# EAGLE design HyperLight_S_rev1.0 (EAGLE 9.3.2)
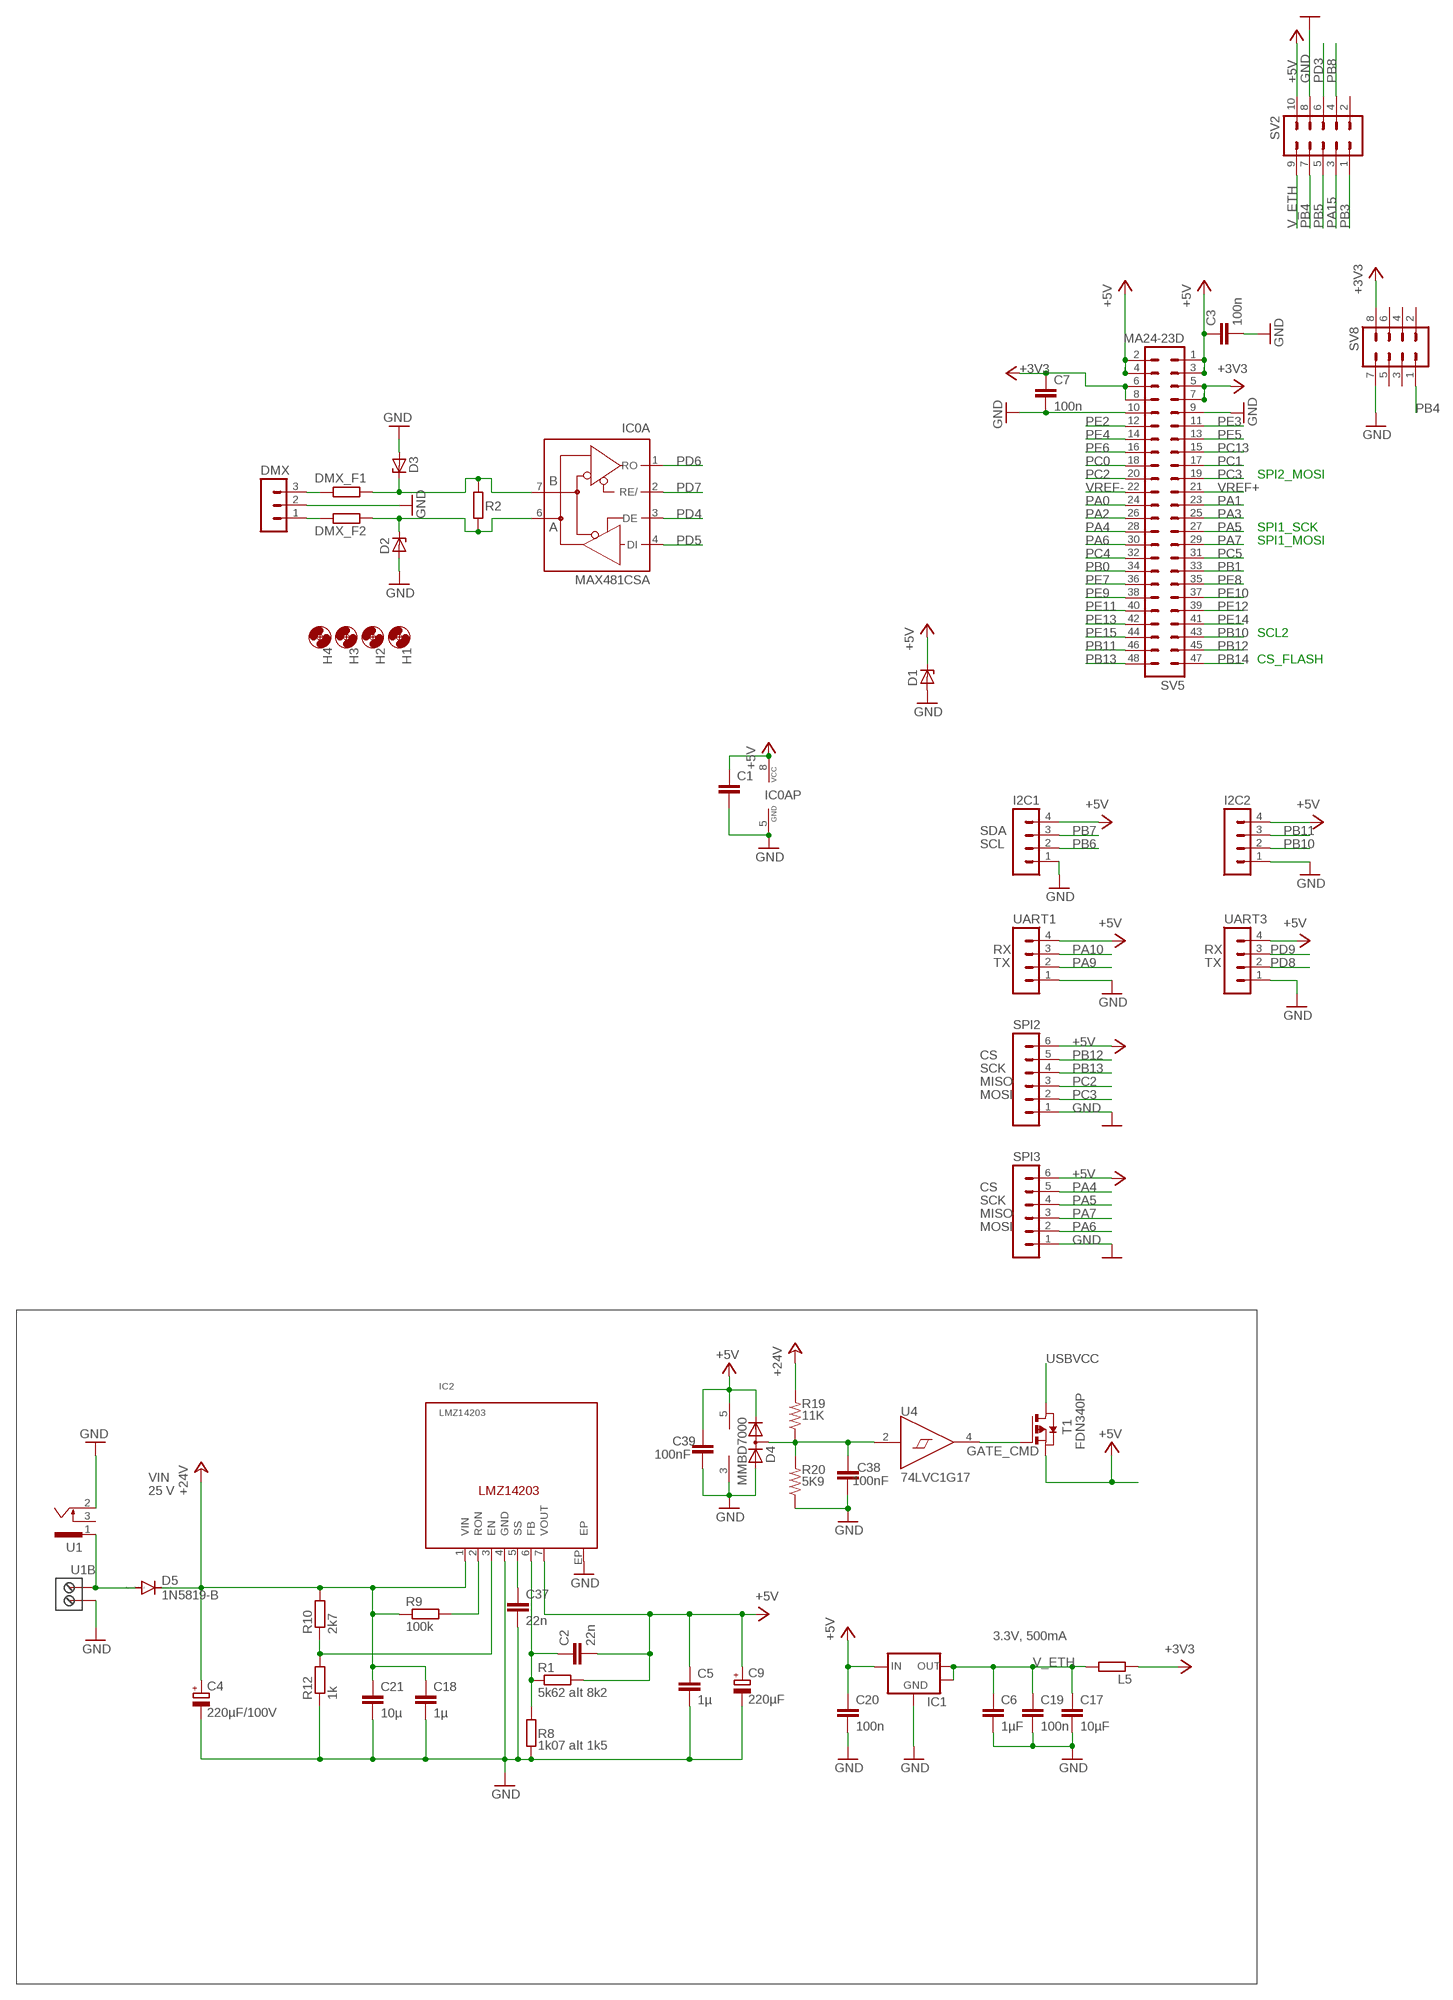
[diagram p0: schematic, sheet 1, part 1 of 2]
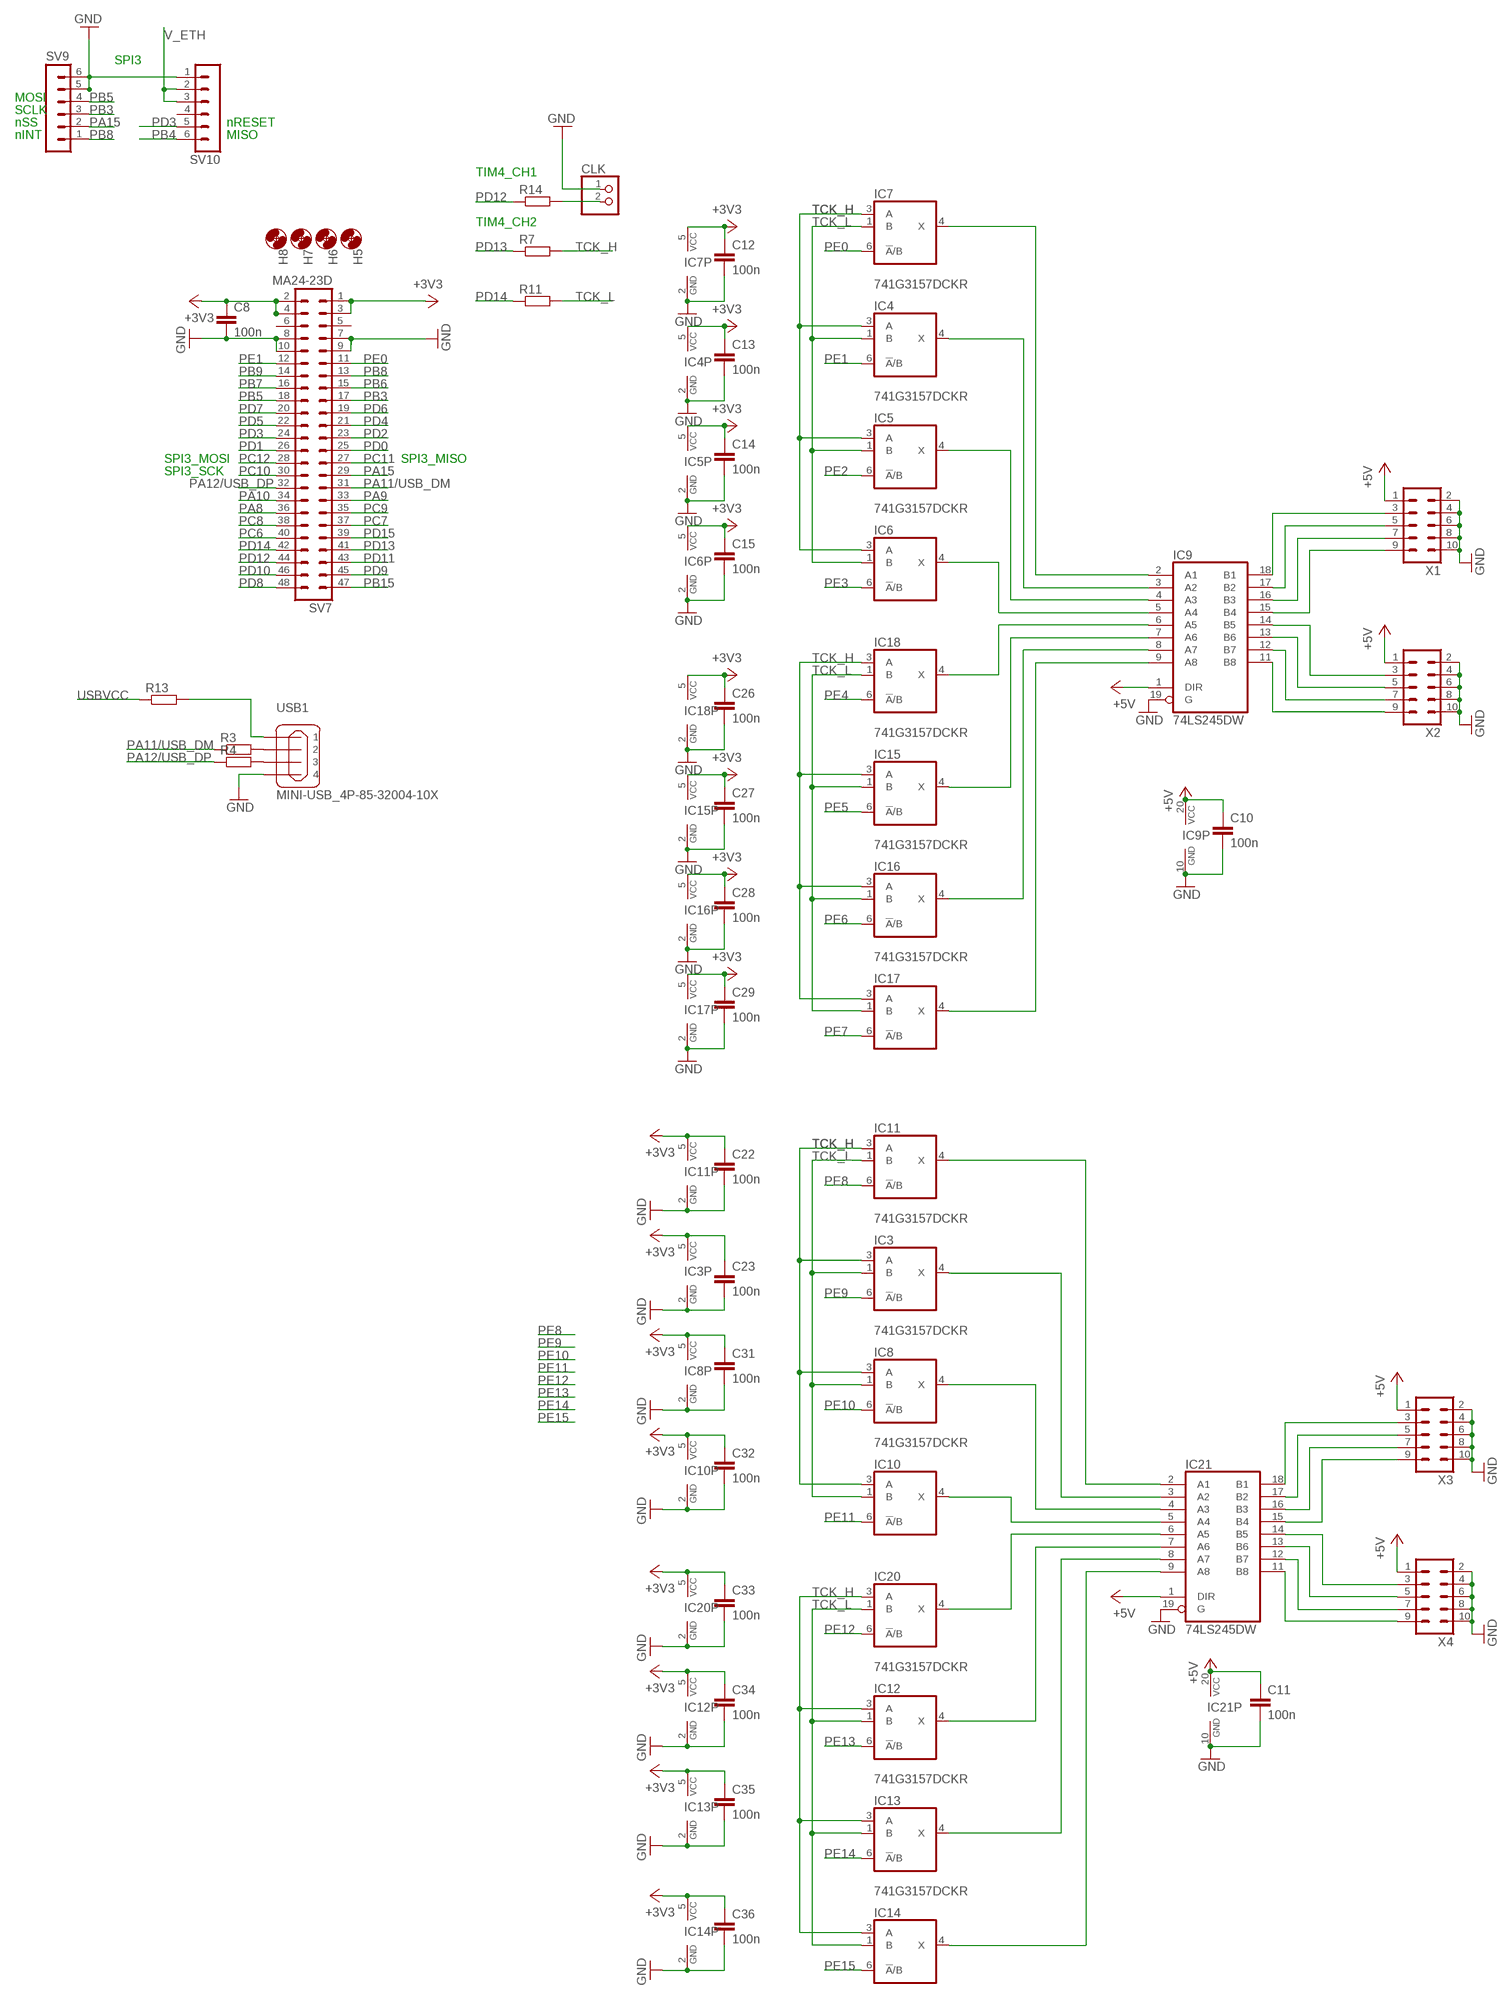
[diagram p1: schematic, sheet 1, part 2 of 2]

## Parts
C1  C-EUC0805  [C0805]
C2  22n  C-EUC0805  [C0805]
C3  100n  C-EUC0805  [C0805]
C4  220µF/100V  CPOL-EU153CLV-0810  [153CLV-0810]
C5  1µ  C-EUC0805  [C0805]
C6  1µF  C-EUC0805  [C0805]
C7  100n  C-EUC0805  [C0805]
C8  100n  C-EUC0805  [C0805]
C9  220µF  CPOL-EU153CLV-0810  [153CLV-0810]
C10  100n  C-EUC0603  [C0603]
C11  100n  C-EUC0603  [C0603]
C12  100n  C-EUC0603  [C0603]
C13  100n  C-EUC0603  [C0603]
C14  100n  C-EUC0603  [C0603]
C15  100n  C-EUC0603  [C0603]
C17  10µF  C-EUC0805  [C0805]
C18  1µ  C-EUC0805  [C0805]
C19  100n  C-EUC0805  [C0805]
C20  100n  C-EUC0805  [C0805]
C21  10µ  C-EUC0805  [C0805]
C22  100n  C-EUC0603  [C0603]
C23  100n  C-EUC0603  [C0603]
C26  100n  C-EUC0603  [C0603]
C27  100n  C-EUC0603  [C0603]
C28  100n  C-EUC0603  [C0603]
C29  100n  C-EUC0603  [C0603]
C31  100n  C-EUC0603  [C0603]
C32  100n  C-EUC0603  [C0603]
C33  100n  C-EUC0603  [C0603]
C34  100n  C-EUC0603  [C0603]
C35  100n  C-EUC0603  [C0603]
C36  100n  C-EUC0603  [C0603]
C37  22n  C-EUC0805  [C0805]
C38  100nF  C-EUC0402  [C0402]
C39  100nF  C-EUC0402  [C0402]
CLK  PINHD-1X2  [1X02]
D1  ZENER-DIODESMB  [SMB]
D2  ZENER-DIODESMB  [SMB]
D3  ZENER-DIODESMB  [SMB]
D4  MMBD7000  BAV199W  [SC70-3-R]
D5  1N5819-B  ES2D  [SMB]
DMX  MA03-1  [MA03-1]
DMX_F1  R-EU_R0805  [R0805@1]
DMX_F2  R-EU_R0805  [R0805@1]
H1  MOUNT-HOLE3.2  [3,2]
H2  MOUNT-HOLE3.2  [3,2]
H3  MOUNT-HOLE3.2  [3,2]
H4  MOUNT-HOLE3.2  [3,2]
H5  MOUNT-HOLE3.2  [3,2]
H6  MOUNT-HOLE3.2  [3,2]
H7  MOUNT-HOLE3.2  [3,2]
H8  MOUNT-HOLE3.2  [3,2]
I2C1  MA04-1  [MA04-1]
I2C2  MA04-1  [MA04-1]
IC0A  MAX481CSA  [SO08]
IC1  LM1117  [SOT223]
IC2  LMZ14203  [TO-PMOD]
IC3  741G3157DCKR  [DCK_R-PDSO-G6]
IC4  741G3157DCKR  [DCK_R-PDSO-G6]
IC5  741G3157DCKR  [DCK_R-PDSO-G6]
IC6  741G3157DCKR  [DCK_R-PDSO-G6]
IC7  741G3157DCKR  [DCK_R-PDSO-G6]
IC8  741G3157DCKR  [DCK_R-PDSO-G6]
IC9  74LS245DW  [SO20W]
IC10  741G3157DCKR  [DCK_R-PDSO-G6]
IC11  741G3157DCKR  [DCK_R-PDSO-G6]
IC12  741G3157DCKR  [DCK_R-PDSO-G6]
IC13  741G3157DCKR  [DCK_R-PDSO-G6]
IC14  741G3157DCKR  [DCK_R-PDSO-G6]
IC15  741G3157DCKR  [DCK_R-PDSO-G6]
IC16  741G3157DCKR  [DCK_R-PDSO-G6]
IC17  741G3157DCKR  [DCK_R-PDSO-G6]
IC18  741G3157DCKR  [DCK_R-PDSO-G6]
IC20  741G3157DCKR  [DCK_R-PDSO-G6]
IC21  74LS245DW  [SO20W]
L5  R-EU_R0603  [R0603]
R1  5k62 alt 8k2  R-EU_R0805  [R0805@1]
R2  R-EU_R0805  [R0805@1]
R3  R-EU_R0805  [R0805@1]
R4  R-EU_R0805  [R0805@1]
R7  R-EU_R0805  [R0805@1]
R8  1k07 alt 1k5  R-EU_R0805  [R0805@1]
R9  100k  R-EU_R0805  [R0805@1]
R10  2k7  R-EU_R0805  [R0805@1]
R11  R-EU_R0805  [R0805@1]
R12  1k  R-EU_R0805  [R0805@1]
R13  R-EU_R1206  [R1206@1]
R14  R-EU_R0805  [R0805@1]
R19  11K  R-US_R0402  [R0402]
R20  5K9  R-US_R0402  [R0402]
SPI2  MA06-1  [MA06-1]
SPI3  MA06-1  [MA06-1]
SV2  MA05-2  [MA05-2]
SV5  MA24-23D  [HDRVR48W64P254_2X24_6096X508X762B]
SV7  MA24-23D  [HDRVR48W64P254_2X24_6096X508X762B]
SV8  MA04-2MALE_3D  [HDRV8W64P254_2X4_1016X508X838B]
SV9  MA06-1FEMALE_3D  [HDRVR6W64P254_1X6_1524X254X762B]
SV10  MA06-1FEMALE_3D  [HDRVR6W64P254_1X6_1524X254X762B]
T1  FDN340P  PMOSSOT23  [SOT-23]
U1  733980-62  [733980-62]
U1B  RIACON101-02  [RIACON101-02]
U4  74LVC1G17  [SOT-553]
UART1  MA04-1  [MA04-1]
UART3  MA04-1  [MA04-1]
USB1  MINI-USB_4P-85-32004-10X  [85-32004-10X]
X1  MA05-2MA05-2S  [MA05-2S]
X2  MA05-2MA05-2S  [MA05-2S]
X3  MA05-2MA05-2S  [MA05-2S]
X4  MA05-2MA05-2S  [MA05-2S]

## Nets
+3V3: C7.1 C8.1 C12.1 C13.1 C14.1 C15.1 C22.1 C23.1 C26.1 C27.1 C28.1 C29.1 C31.1 C32.1 C33.1 C34.1 C35.1 C36.1 IC3.5(VCC) IC4.5(VCC) IC5.5(VCC) IC6.5(VCC) IC7.5(VCC) IC8.5(VCC) IC10.5(VCC) IC11.5(VCC) IC12.5(VCC) IC13.5(VCC) IC14.5(VCC) IC15.5(VCC) IC16.5(VCC) IC17.5(VCC) IC18.5(VCC) IC20.5(VCC) L5.1 SV5.5 SV5.6 SV5.7 SV5.8 SV7.1 SV7.2 SV7.3 SV7.4 SV8.8
+5V: C1.1 C2.2 C3.1 C5.1 C9.+ C10.1 C11.1 C20.1 C39.2 D1.C D4.2(C) I2C1.4 I2C2.4 IC0A.8(VCC) IC1.3(IN) IC2.7(VOUT) IC9.1(DIR) IC9.20(VCC) IC21.1(DIR) IC21.20(VCC) R1.2 SPI2.6 SPI3.6 SV2.10 SV5.1 SV5.2 SV5.3 SV5.4 T1.2(S) U4.5(VCC) UART1.4 UART3.4 X1.1 X2.1 X3.1 X4.1
+24V: C4.+ C18.1 C21.1 D5.C IC2.1(VIN) R9.1 R10.2 R19.2
CMP: C38.2 D4.3(AC) R19.1 R20.2 U4.2(A)
GATE_CMD: T1.3(G) U4.4(Y)
GND: C1.2 C3.2 C4.- C5.2 C6.2 C7.2 C8.2 C9.- C10.2 C11.2 C12.2 C13.2 C14.2 C15.2 C17.2 C18.2 C19.2 C20.2 C21.2 C22.2 C23.2 C26.2 C27.2 C28.2 C29.2 C31.2 C32.2 C33.2 C34.2 C35.2 C36.2 C37.2 C38.1 C39.1 CLK.1 D1.A D2.A D3.A D4.1(A) DMX.2 I2C1.1 I2C2.1 IC0A.5(GND) IC1.1(GND) IC2.4(GND) IC2.EP IC3.2(GND) IC4.2(GND) IC5.2(GND) IC6.2(GND) IC7.2(GND) IC8.2(GND) IC9.10(GND) IC9.19(G) IC10.2(GND) IC11.2(GND) IC12.2(GND) IC13.2(GND) IC14.2(GND) IC15.2(GND) IC16.2(GND) IC17.2(GND) IC18.2(GND) IC20.2(GND) IC21.10(GND) IC21.19(G) R8.1 R12.1 R20.1 SPI2.1 SPI3.1 SV2.8 SV5.9 SV5.10 SV7.7 SV7.8 SV7.9 SV7.10 SV8.7 SV9.5 SV9.6 SV10.1 U1.2 U1B.P$2 U4.3(GND) UART1.1 UART3.1 USB1.4 X1.2 X1.4 X1.6 X1.8 X1.10 X2.2 X2.4 X2.6 X2.8 X2.10 X3.2 X3.4 X3.6 X3.8 X3.10 X4.2 X4.4 X4.6 X4.8 X4.10
N$1: IC7.4(X) IC9.2(A1)
N$2: IC5.4(X) IC9.4(A3)
N$3: R3.2 USB1.2
N$4: IC6.4(X) IC9.5(A4)
N$9: IC4.4(X) IC9.3(A2)
N$10: IC9.18(B1) X1.3
N$11: D3.C DMX_F1.1 IC0A.7(B) R2.2
N$12: D2.C DMX_F2.1 IC0A.6(A) R2.1
N$13: R4.2 USB1.3
N$16: C2.1 IC2.6(FB) R1.1 R8.2
N$19: IC9.6(A5) IC18.4(X)
N$20: IC2.2(RON) R9.2
N$21: IC11.4(X) IC21.2(A1)
N$22: C37.1 IC2.5(SS)
N$23: IC9.9(A8) IC17.4(X)
N$24: IC2.3(EN) R10.1 R12.2
N$25: D5.A U1.1 U1B.P$1
N$26: IC9.8(A7) IC16.4(X)
N$27: IC9.7(A6) IC15.4(X)
N$28: IC9.17(B2) X1.5
N$29: IC9.16(B3) X1.7
N$30: IC9.15(B4) X1.9
N$31: DMX.3 DMX_F1.2
N$32: DMX.1 DMX_F2.2
N$33: IC8.4(X) IC21.4(A3)
N$34: IC10.4(X) IC21.5(A4)
N$35: IC20.4(X) IC21.6(A5)
N$36: IC14.4(X) IC21.9(A8)
N$37: IC13.4(X) IC21.8(A7)
N$38: IC12.4(X) IC21.7(A6)
N$39: IC3.4(X) IC21.3(A2)
N$40: R13.2 USB1.1
N$41: CLK.2 R14.2
N$42: IC21.18(B1) X3.3
N$43: IC21.17(B2) X3.5
N$44: IC21.16(B3) X3.7
N$45: IC21.15(B4) X3.9
N$46: IC21.14(B5) X4.3
N$47: IC21.13(B6) X4.5
N$48: IC21.12(B7) X4.7
N$49: IC21.11(B8) X4.9
N$50: IC9.14(B5) X2.3
N$51: IC9.13(B6) X2.5
N$52: IC9.12(B7) X2.7
N$53: IC9.11(B8) X2.9
PA0: SV5.24
PA1: SV5.23
PA2: SV5.26
PA3: SV5.25
PA4: SPI3.5 SV5.28
PA5: SPI3.4 SV5.27
PA6: SPI3.2 SV5.30
PA7: SPI3.3 SV5.29
PA8: SV7.36
PA9: SV7.33 UART1.2
PA10: SV7.34 UART1.3
PA11/USB_DM: R3.1 SV7.31
PA12/USB_DP: R4.1 SV7.32
PA15: SV2.3 SV7.29 SV9.2
PB0: SV5.34
PB1: SV5.33
PB3: SV2.1 SV7.17 SV9.3
PB4: SV2.7 SV8.1 SV10.6
PB5: SV2.5 SV7.18 SV9.4
PB6: I2C1.2 SV7.15
PB7: I2C1.3 SV7.16
PB8: SV2.4 SV7.13 SV9.1
PB9: SV7.14
PB10: I2C2.2 SV5.43
PB11: I2C2.3 SV5.46
PB12: SPI2.5 SV5.45
PB13: SPI2.4 SV5.48
PB14: SV5.47
PB15: SV7.47
PC0: SV5.18
PC1: SV5.17
PC2: SPI2.3 SV5.20
PC3: SPI2.2 SV5.19
PC4: SV5.32
PC5: SV5.31
PC6: SV7.40
PC7: SV7.37
PC8: SV7.38
PC9: SV7.35
PC10: SV7.30
PC11: SV7.27
PC12: SV7.28
PC13: SV5.15
PD0: SV7.25
PD1: SV7.26
PD2: SV7.23
PD3: SV2.6 SV7.24 SV10.5
PD4: IC0A.3(DE) SV7.21
PD5: IC0A.4(DI) SV7.22
PD6: IC0A.1(RO) SV7.19
PD7: IC0A.2(RE/) SV7.20
PD8: SV7.48 UART3.2
PD9: SV7.45 UART3.3
PD10: SV7.46
PD11: SV7.43
PD12: R14.1 SV7.44
PD13: R7.1 SV7.41
PD14: R11.1 SV7.42
PD15: SV7.39
PE0: IC7.6(!A!/B) SV7.11
PE1: IC4.6(!A!/B) SV7.12
PE2: IC5.6(!A!/B) SV5.12
PE3: IC6.6(!A!/B) SV5.11
PE4: IC18.6(!A!/B) SV5.14
PE5: IC15.6(!A!/B) SV5.13
PE6: IC16.6(!A!/B) SV5.16
PE7: IC17.6(!A!/B) SV5.36
PE8: IC11.6(!A!/B) SV5.35
PE9: IC3.6(!A!/B) SV5.38
PE10: IC8.6(!A!/B) SV5.37
PE11: IC10.6(!A!/B) SV5.40
PE12: IC20.6(!A!/B) SV5.39
PE13: IC12.6(!A!/B) SV5.42
PE14: IC13.6(!A!/B) SV5.41
PE15: IC14.6(!A!/B) SV5.44
TCK_H: IC3.3(A) IC4.3(A) IC5.3(A) IC6.3(A) IC7.3(A) IC8.3(A) IC10.3(A) IC11.3(A) IC12.3(A) IC13.3(A) IC14.3(A) IC15.3(A) IC16.3(A) IC17.3(A) IC18.3(A) IC20.3(A) R7.2
TCK_L: IC3.1(B) IC4.1(B) IC5.1(B) IC6.1(B) IC7.1(B) IC8.1(B) IC10.1(B) IC11.1(B) IC12.1(B) IC13.1(B) IC14.1(B) IC15.1(B) IC16.1(B) IC17.1(B) IC18.1(B) IC20.1(B) R11.2
USBVCC [usbvcc]: R13.1 T1.1(D)
V_ETH: C6.1 C17.1 C19.1 IC1.2(OUT) IC1.4(PAD) L5.2 SV2.9 SV10.2 SV10.3
VREF+: SV5.21
VREF-: SV5.22
Unconnected: SV2.2 SV7.5 SV7.6 SV8.2 SV8.3 SV8.4 SV8.5 SV8.6 SV10.4 U1.3

## Notes on the sheet
- SPI3
- MOSI
- SCLK
- nSS | nRESET
- nINT | MISO
- TIM4_CH1
- TIM4_CH2
- SPI2_MOSI
- SPI3_MOSI | SPI3_MISO
- SPI1_SCK | SPI3_SCK
- SPI1_MOSI
- SCL2
- CS_FLASH
- SDA
- SCL
- RX | RX
- TX | TX
- CS
- SCK
- MISO
- MOSI
- CS
- SCK
- MISO
- MOSI
- VIN
- 25 V
- 3.3V, 500mA

## Library data of the parts
C1 C10-C15 C22 C23 C26-C29 C31-C36 C39 = rcl:C-EU: CAPACITOR, European symbol
C2 C3 C5-C8 C17-C21 C37 = rcl:C-EU: CAPACITOR, European symbol; SPICEPREFIX: C
C4 C9 = rcl:CPOL-EU: POLARIZED CAPACITOR, European symbol; SPICEPREFIX: C
C38 = SmartPrj:C-EU: CAPACITOR, European symbol
CLK = pinhead:PINHD-1X2: PIN HEADER
D1-D3 = diode:ZENER-DIODE: Z-Diode
D4 = diode:BAV199: DIODE low-leakage double diode
D5 = diode:ES2D: DIODE super fast rectifier, 2 A
DMX = con-pin-header:MA03-1: PIN HEADER
DMX_F1 DMX_F2 R1-R4 R7-R14 = rcl:R-EU_: RESISTOR, European symbol
H1-H8 = holes_new:MOUNT-HOLE: MOUNTING HOLE with drill center marker
I2C1 I2C2 UART1 UART3 = con-pin-header:MA04-1: PIN HEADER
IC0A = maxim:MAX481CSA: RS485 TRANSEIVER; MF: MAXIM; MPN: MAX481CSA; OC_FARNELL: unknown; OC_NEWARK: 90C3817
IC1 = v-reg-3:LM1117
IC2 = ti_import:LMZ14203
IC3-IC8 IC10-IC18 IC20 = 74xx-little-de:74*1G3157: Single-Pole, Double-Throw Analog Switch Source: http://focus.ti.com/lit/ds/symlink/sn74lvc1g3157.pdf
IC9 IC21 = 74xx-eu:74*245: Octal BUS TRANSCEIVER, 3-state
L5 = rcl:R-EU_: RESISTOR, European symbol; SPICEPREFIX: R
R19 R20 = rcl:R-US_: RESISTOR, American symbol
SPI2 SPI3 SV9 SV10 = con-pin-header:MA06-1: PIN HEADER
SV2 X1-X4 = con-pin-header:MA05-2: PIN HEADER
SV5 SV7 = con-pin-header:MA24-2
SV8 = con-pin-header:MA04-2: PIN HEADER
T1 = zetex:PMOSSOT23: MOS FET
U1 = con-conrad:73398?: FEMALE PRINT CONNECTOR Niedervolt-Steckverbinder Distributor Conrad
U1B = con-riacon:RIACON101-02
U4 = bibaja:74LVC1G17: Single Schmitt-Trigger Buffer, 1.65-5.5V (Alternate part NL17SZ17)
USB1 = con-cypressindustries:MINI-USB_4P-: MINI USB 4 Pol. Source: www.cypressindustries.com; OC_FARNELL: unknown; OC_NEWARK: unknown

## Net classes
1 power: width 0.61 mm, drill 0.508 mm, clearance 0.152 mm
2 gnd: width 0.305 mm, drill 0.508 mm, clearance 0.152 mm
3 usbvcc: width 0.508 mm, drill 0.508 mm, clearance 0.152 mm

## Board
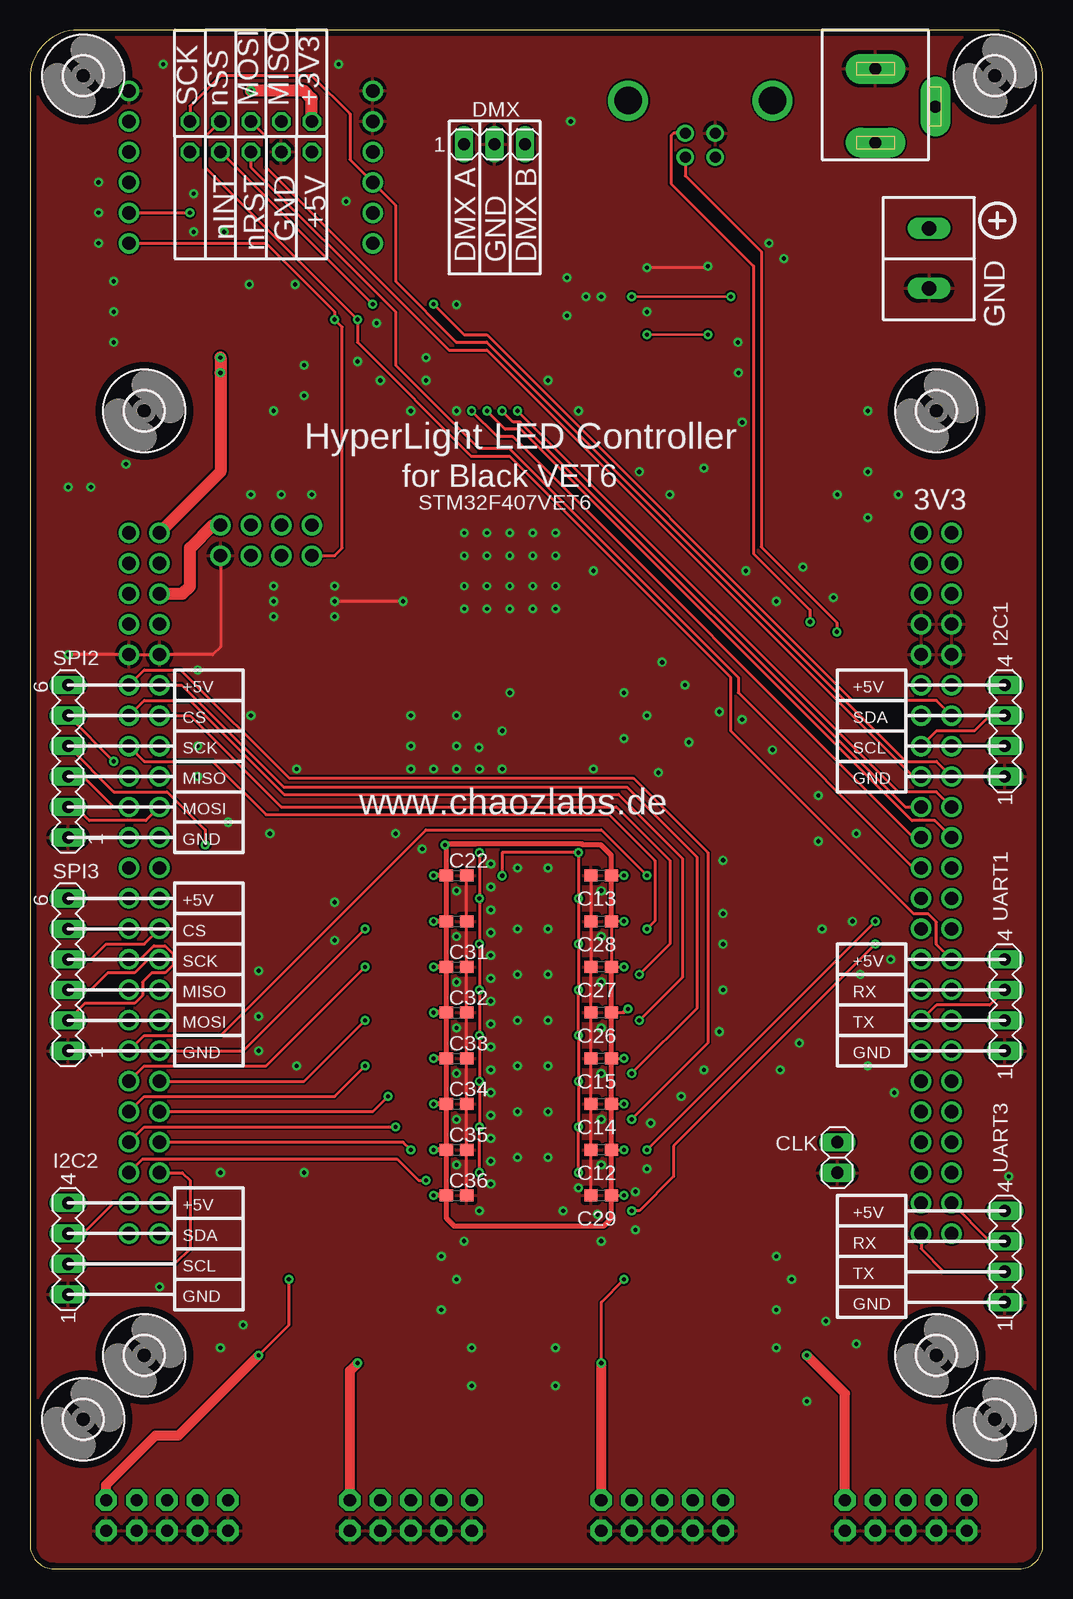
[diagram p2: board, top side]
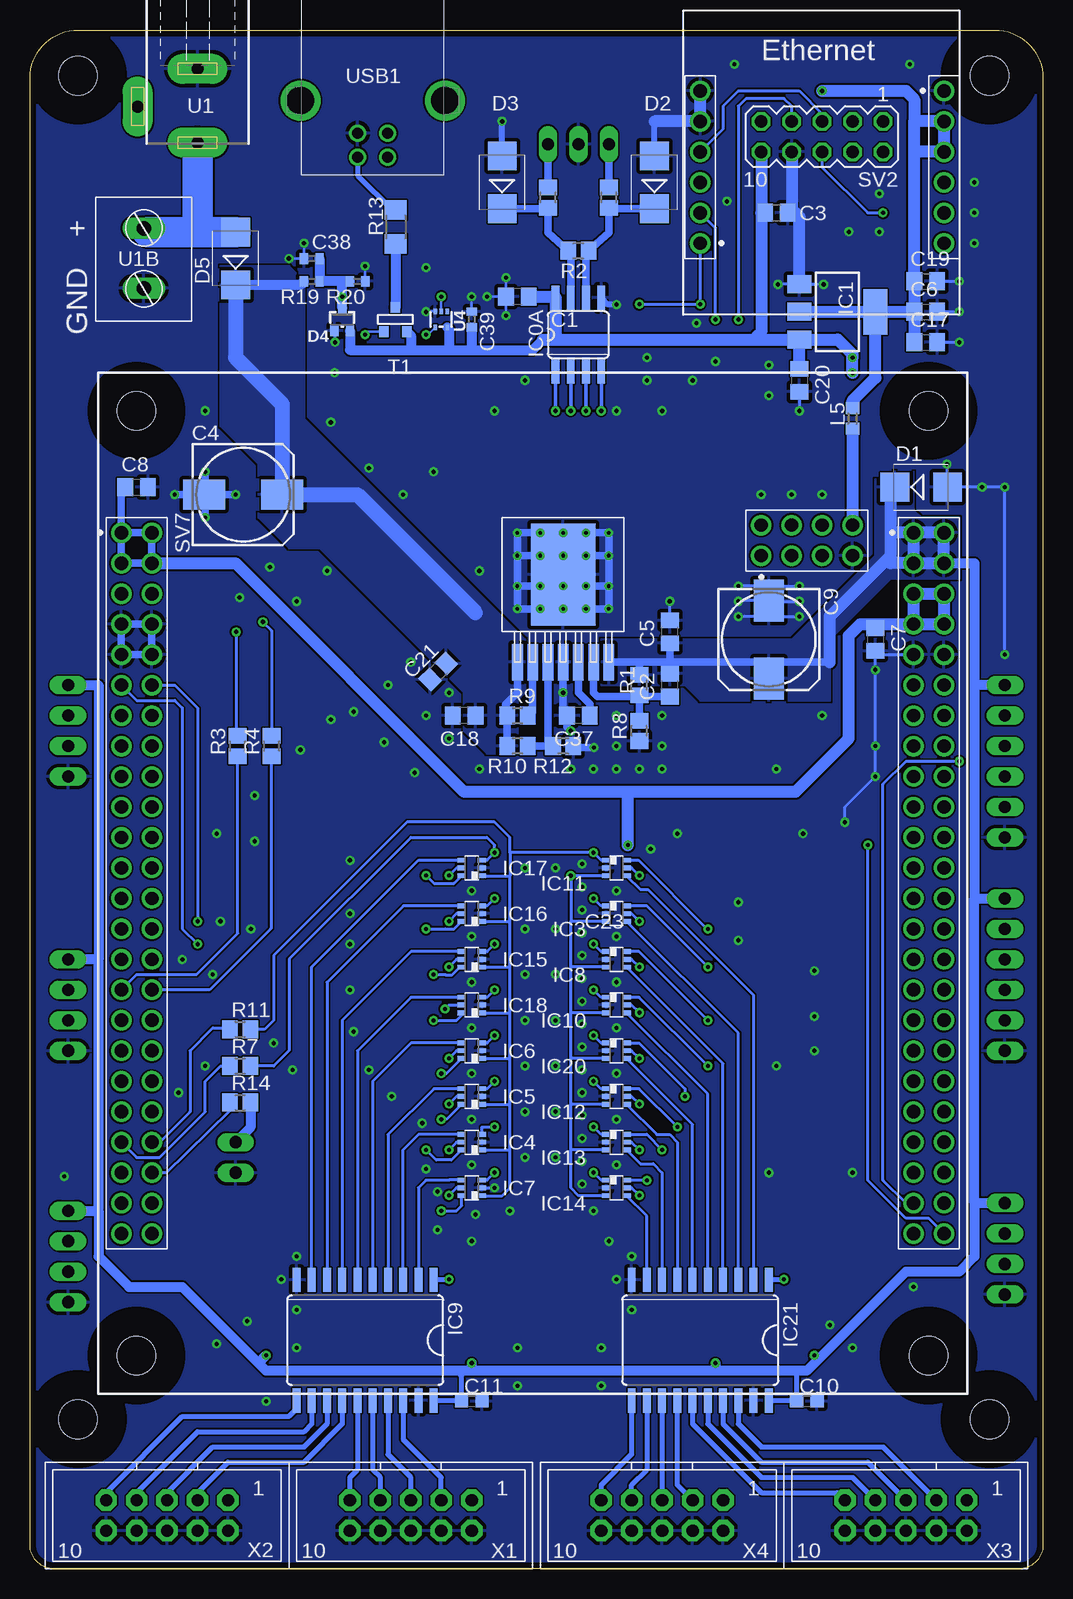
[diagram p3: board, bottom side, seen from below]

Size 84.46 x 128.27 mm. Coordinates in mm from the lower left corner, seen from the top.
Outline: 0,124.27 0,2 arc90 2,0 82.46,0 arc90 84.46,2 84.46,124.27 arc90 80.46,128.27 4,128.27 arc90 0,124.27
Copper layers (1*16): Top 0.035mm / dielectric 1.5mm / Bottom 0.035mm
Design rules "default_2": minimum track width 6mil, minimum drill 0.35mm, track to track 6mil, track to pad 6mil, pad to pad 6mil, via to via 6mil, smd to smd 6mil, copper to edge 20mil, drill to drill 6mil, minimum pad ring 10mil, minimum via ring 8mil, stop-mask expansion 4mil, vias tented up to drill 14mil, thermal gap 12mil

### Footprints (pad centres in the part's own frame; a part is rotated, then mirrored left to right if it is on the bottom)
C0805 = smd 1.3 x 1.5: 1 -0.95,0; 2 0.95,0
153CLV-0810 = smd 3.5 x 2.5: + 3.25,0; - -3.25,0
C0603 = smd 1.1 x 1: 1 -0.85,0; 2 0.85,0
C0402 = smd 0.7 x 0.9: 1 -0.65,0; 2 0.65,0
1X02 = drill 1.016 long: 1 -1.27,0; 2 1.27,0
SMB = smd 2.4 x 2.4: A 2.2,0; C -2.2,0
SC70-3-R = smd 0.7 x 0.9: 1 -0.65,-0.95; 2 0.65,-0.95; 3 0,0.95
MA03-1 = drill 1.016 long: 1 -2.54,0; 2 0,0; 3 2.54,0
R0805@1 = smd 1.3 x 1.5: 1 -0.85,0; 2 0.85,0
3,2 = hole 3.2: 0,0
MA04-1 = drill 1.016 long: 1 -3.81,0; 2 -1.27,0; 3 1.27,0; 4 3.81,0
SO08 = smd 0.66 x 2.032: 1 -1.905,-3.073; 2 -0.635,-3.073; 3 0.635,-3.073; 4 1.905,-3.073; 5 1.905,3.073; 6 0.635,3.073; 7 -0.635,3.073; 8 -1.905,3.073
SOT223 = smd 1.5 x 2: 1 -2.3,-3.15; 2 0,-3.15; 3 2.3,-3.15 | smd 3.8 x 2: 4 0,3.15
TO-PMOD = smd 0.89 x 3.06: 1 -3.81,0; 2 -2.54,0; 3 -1.27,0; 4 0,0; 5 1.27,0; 6 2.54,0; 7 3.81,0 | smd 5.35 x 8.51: EP 0,7.305
DCK_R-PDSO-G6 = smd 0.4 x 0.7: 1 -0.65,-0.85; 2 0,-0.85; 3 0.65,-0.85; 4 0.65,0.85; 5 0,0.85; 6 -0.65,0.85
SO20W = smd 0.66 x 2.032: 1 -5.715,-5.029; 2 -4.445,-5.029; 3 -3.175,-5.029; 4 -1.905,-5.029; 5 -0.635,-5.029; 6 0.635,-5.029; 7 1.905,-5.029; 8 3.175,-5.029; 9 4.445,-5.029; 10 5.715,-5.029; 11 5.715,5.029; 12 4.445,5.029; 13 3.175,5.029; 14 1.905,5.029; 15 0.635,5.029; 16 -0.635,5.029; 17 -1.905,5.029; 18 -3.175,5.029; 19 -4.445,5.029; 20 -5.715,5.029
R0603 = smd 1 x 1.1: 1 -0.85,0; 2 0.85,0
R1206@1 = smd 1.6 x 1.803: 1 -1.422,0; 2 1.422,0
R0402 = smd 0.7 x 0.9: 1 -0.65,0; 2 0.65,0
MA06-1 = drill 1.016 long: 1 -6.35,0; 2 -3.81,0; 3 -1.27,0; 4 1.27,0; 5 3.81,0; 6 6.35,0
MA05-2 = drill 1.016 octagon: 1 -5.08,-1.27; 2 -5.08,1.27; 3 -2.54,-1.27; 4 -2.54,1.27; 5 0,-1.27; 6 0,1.27; 7 2.54,-1.27; 8 2.54,1.27; 9 5.08,-1.27; 10 5.08,1.27
HDRVR48W64P254_2X24_6096X508X762B = drill 1.105 pad 1.705: 1 0,0; 2 0,2.54; 3 2.54,0; 4 2.54,2.54; 5 5.08,0; 6 5.08,2.54; 7 7.62,0; 8 7.62,2.54; 9 10.16,0; 10 10.16,2.54; 11 12.7,0; 12 12.7,2.54; 13 15.24,0; 14 15.24,2.54; 15 17.78,0; 16 17.78,2.54; 17 20.32,0; 18 20.32,2.54; 19 22.86,0; 20 22.86,2.54; 21 25.4,0; 22 25.4,2.54; 23 27.94,0; 24 27.94,2.54; 25 30.48,0; 26 30.48,2.54; 27 33.02,0; 28 33.02,2.54; 29 35.56,0; 30 35.56,2.54; 31 38.1,0; 32 38.1,2.54; 33 40.64,0; 34 40.64,2.54; 35 43.18,0; 36 43.18,2.54; 37 45.72,0; 38 45.72,2.54; 39 48.26,0; 40 48.26,2.54; 41 50.8,0; 42 50.8,2.54; 43 53.34,0; 44 53.34,2.54; 45 55.88,0; 46 55.88,2.54; 47 58.42,0; 48 58.42,2.54
HDRV8W64P254_2X4_1016X508X838B = drill 1.105 pad 1.705: 1 0,0; 2 0,2.54; 3 2.54,0; 4 2.54,2.54; 5 5.08,0; 6 5.08,2.54; 7 7.62,0; 8 7.62,2.54
HDRVR6W64P254_1X6_1524X254X762B = drill 1.105 pad 1.705: 1 0,0; 2 2.54,0; 3 5.08,0; 4 7.62,0; 5 10.16,0; 6 12.7,0
SOT-23 = smd 0.787 x 0.889: 1 0.025,-1.016; 2 -0.94,1.016; 3 0.991,1.016
733980-62 = drill 1 pad 2.5 long: 1 0,8.57; 2 0,2.42; 3 5,5.57
RIACON101-02 = drill 1.2 long: P$1 -0.03,2.52; P$2 -0.03,-2.485
SOT-553 = smd 0.3 x 0.45: 1 -0.5,-0.675; 2 0,-0.675; 3 0.5,-0.675; 4 0.5,0.675; 5 -0.5,0.675
85-32004-10X = drill 0.92 pad 1.27: 1 4.71,-1.25; 2 4.71,1.25; 3 2.71,1.25; 4 2.71,-1.25 | drill 2.3 pad 3: M1 0,6.02; M2 0,-6.02
MA05-2S = drill 1.016 pad 1.778 octagon: 1 -5.08,-1.27; 2 -5.08,1.27; 3 -2.54,-1.27; 4 -2.54,1.27; 5 0,-1.27; 6 0,1.27; 7 2.54,-1.27; 8 2.54,1.27; 9 5.08,-1.27; 10 5.08,1.27

### Placement (x,y rotation side)
C1  43.81,106.04 180 bottom
C2  31.12,73.66 90 bottom
C3  22.23,113.03 0 bottom
C4  66.67,89.53 0 bottom
C5  31.12,78.1 90 bottom
C6  9.78,104.77 0 bottom
C7  13.97,77.47 270 bottom
C8  75.56,90.17 0 bottom
C9  22.86,77.47 270 bottom
C10  19.69,13.97 0 bottom
C11  47.62,13.97 0 bottom
C12  47.62,34.93 180 top
C13  47.62,57.79 180 top
C14  47.62,38.73 180 top
C15  47.62,42.55 180 top
C17  9.78,102.23 0 bottom
C18  48.26,71.12 180 bottom
C19  9.78,107.31 0 bottom
C20  20.32,99.06 270 bottom
C21  50.42,74.8 225 bottom
C22  35.56,57.79 0 top
C23  35.56,53.98 0 top
C26  47.62,46.36 180 top
C27  47.62,50.16 180 top
C28  47.62,53.98 180 top
C29  47.62,31.12 180 top
C31  35.56,50.16 0 top
C32  35.56,46.36 0 top
C33  35.56,42.55 0 top
C34  35.56,38.73 0 top
C35  35.56,34.93 0 top
C36  35.56,31.12 0 top
C37  38.73,71.12 180 bottom
C38  60.96,109.22 0 bottom
C39  47.62,104.14 270 bottom
CLK  67.31,34.29 90 top
D1  10.16,90.17 0 bottom
D2  32.39,115.57 90 bottom
D3  45.09,115.57 90 bottom
D4  58.42,104.14 0 bottom
D5  67.31,109.22 90 bottom
DMX  38.73,118.74 0 top
DMX_F1  41.27,114.3 90 bottom
DMX_F2  36.2,114.3 90 bottom
H1  4.45,12.46 0 top
H2  80.44,12.46 0 top
H3  4.45,124.46 0 top
H4  80.44,124.46 0 top
H5  9.53,17.78 0 top
H6  75.56,17.78 0 top
H7  9.53,96.52 0 top
H8  75.56,96.52 0 top
I2C1  81.28,69.85 90 top
I2C2  3.18,26.67 90 top
IC0A  38.73,102.87 0 bottom
IC1  17.14,104.77 270 bottom
IC2  40.01,75.56 0 bottom
IC3  35.56,54.61 270 bottom
IC4  47.62,35.56 90 bottom
IC5  47.62,39.37 90 bottom
IC6  47.62,43.18 90 bottom
IC7  47.62,31.75 90 bottom
IC8  35.56,50.8 270 bottom
IC9  56.52,19.05 180 bottom
IC10  35.56,46.99 270 bottom
IC11  35.56,58.42 270 bottom
IC12  35.56,39.37 270 bottom
IC13  35.56,35.56 270 bottom
IC14  35.56,31.75 270 bottom
IC15  47.62,50.8 90 bottom
IC16  47.62,54.61 90 bottom
IC17  47.62,58.42 90 bottom
IC18  47.62,46.99 90 bottom
IC20  35.56,43.18 270 bottom
IC21  28.57,19.05 180 bottom
L5  15.88,95.88 90 bottom
R1  33.66,73.66 90 bottom
R2  38.73,109.85 180 bottom
R3  67.13,68.58 90 bottom
R4  64.31,68.58 90 bottom
R7  66.93,41.91 0 bottom
R8  33.66,69.85 90 bottom
R9  43.81,71.12 0 bottom
R10  43.81,68.58 180 bottom
R11  66.93,44.96 0 bottom
R12  40.01,68.58 180 bottom
R13  53.98,111.85 90 bottom
R14  66.93,38.86 0 bottom
R19  60.96,107.31 180 bottom
R20  57.15,107.31 180 bottom
SPI2  3.18,67.31 90 top
SPI3  3.18,49.53 90 top
SV2  18.41,119.38 180 bottom
SV5  10.79,86.36 270 bottom
SV7  76.84,86.36 270 bottom
SV8  23.5,84.45 0 bottom
SV9  28.57,110.49 90 bottom
SV10  8.26,123.19 270 bottom
T1  53.98,104.14 180 bottom
U1  70.49,127.46 180 bottom
U1B  74.93,109.22 0 bottom
U4  50.16,104.14 180 bottom
UART1  81.28,46.99 90 top
UART3  81.28,26.04 90 top
USB1  55.88,122.38 270 bottom
X1  52.7,4.45 180 bottom
X2  73.03,4.45 180 bottom
X3  11.43,4.45 180 bottom
X4  31.75,4.45 180 bottom

### Tracks (layer width: path | path; a pad name or v marks a point on that pad's centre or on a via)
+3V3  (via drill 0.35)
  Top 0.152: v49.85,46.66 49.95,46.46 49.45,46.46 49.45,46.36
  Top 0.254: 34.71,34.29 C35.1 C34.1 | v49.53,53.98 C28.1 C27.1 v49.53,50.16 | C15.1 v49.53,42.55 | C14.1 v49.53,38.73 | C12.1 v49.53,34.93 | C29.1 v49.53,31.12 | C13.1 48.9,57.79 v49.53,57.79 | 34.92,60.33 37.17,60.33 37.19,60.35 47.6,60.35 | 34.92,60.33 34.71,60.11 C22.1 | v34.61,60.33 34.92,60.33 | C26.1 49.45,46.36 49.53,46.36 49.85,46.67
  Top 0.406: C22.1 34.71,60.22 v34.61,60.33 34.71,60.42 46.02,60.42 46.1,60.35 47.6,60.35 48.48,59.48 C13.1 C28.1 48.48,57.37 48.9,57.79 | C27.1 C26.1 C15.1 C14.1 C12.1 C29.1 48.48,29.21 47.84,28.57 35.34,28.57 34.71,29.21 C36.1 | C23.1 C22.1 | C22.1 v33.66,57.79 | C23.1 v33.66,53.98 | C31.1 v33.66,50.16 | C31.1 C23.1 | C32.1 C31.1 | C32.1 v33.66,46.36 | C33.1 C32.1 | C33.1 v33.66,42.55 | C33.1 C34.1 34.29,38.73 | 34.29,38.73 v33.66,38.73 | 34.29,38.73 34.71,38.31 C35.1 v33.66,34.93 | C36.1 34.71,34.29 | C36.1 v33.66,31.12
  Top 1.016: SV5.5 12.7,81.28 13.34,81.91 13.34,85.09 15.24,86.99 SV8.8
  Bottom 0.254: 76.84,89.85 C8.1 | C7.1 13.97,78.74 | IC17.5 48.9,58.41 v49.53,57.79 | IC16.5 48.9,54.61 v49.53,53.98 | v49.85,46.66 49.52,46.99 IC18.5 | IC15.5 48.9,50.8 v49.53,50.16 | IC6.5 48.9,43.18 v49.53,42.55 | IC5.5 48.9,39.37 v49.53,38.73 | IC4.5 48.9,35.56 v49.53,34.93 | IC7.5 48.9,31.75 v49.53,31.12 | IC14.5 34.29,31.75 v33.66,31.12 | IC13.5 34.29,35.56 v33.66,34.93 | IC12.5 34.29,39.37 v33.66,38.73 | IC20.5 34.29,43.18 v33.66,42.55 | IC10.5 34.29,46.99 v33.66,46.36 | IC8.5 34.29,50.8 v33.66,50.16 | IC3.5 34.29,54.61 v33.66,53.98 | IC11.5 34.29,58.42 v33.66,57.79
  Bottom 0.61: SV7.1 SV7.2 SV7.4 SV7.3 SV7.1 | SV7.1 76.84,89.85
  Bottom 1.016: SV5.7 13.97,78.74 15.24,78.74 16.19,77.79 16.19,69.21 20.64,64.77 34.61,64.77 | L5.1 SV8.8 | SV5.7 SV5.8 SV5.6 SV5.5 SV5.7 | SV7.4 67.31,83.82 48.26,64.77 34.61,64.77 | v34.61,60.33 34.61,64.77
+5V  (via drill 0.35)
  Top 0.254: v47.62,17.14 47.62,22.23 v49.53,24.13 | v19.05,17.78 21.59,20.32 v21.59,24.13
  Top 0.813: v19.05,17.78 12.38,11.11 10.48,11.11 6.35,6.99 X3.1 | v64.77,17.78 67.94,14.61 X2.1 | X1.1 v47.62,17.14 | X4.1 26.67,16.51 v27.3,17.14
  Top 1.016: SV5.1 15.88,91.44 v15.88,99.69 v15.88,100.96
  Bottom 0.254: v49.53,24.13 49.58,24.08 | v21.59,24.13 21.64,24.08 | 40.64,102.87 40.64,102.45
  Bottom 0.406: 20.32,16.51 20.54,16.3 C10.1 20.59,14.02 IC21.20 | 48.9,16.51 48.48,16.09 C11.1 48.53,14.02 IC9.20 | 49.58,24.08 IC9.1 | 21.64,24.08 IC21.1
  Bottom 0.61: 40.64,106.58 IC0A.8 | IC2.7 33.66,75.56 | 33.66,75.56 31.12,75.56 | R1.2 33.66,75.56 | C2.2 31.12,75.56 | C5.1 31.12,75.56 | 31.12,75.56 22.86,75.56 | 22.86,75.56 17.78,75.56 | C9.+ 22.86,75.56
  Bottom 0.813: UART3.4 78.74,29.84 | 78.74,29.84 78.74,50.8 | 78.74,50.8 UART1.4 | I2C1.4 78.74,73.66 78.74,50.8 | 78.74,29.84 78.74,26.04 76.2,23.5 71.75,23.5 65.41,17.14 | 5.71,30.48 5.71,26.04 6.99,24.77 11.43,24.77 18.73,17.46 | 5.71,30.48 I2C2.4 | 5.71,30.48 5.71,55.88 | 5.71,55.88 SPI3.6 | SPI2.6 5.71,73.66 | 5.71,73.66 5.71,55.88 | D4.2 57.79,103.17 57.79,101.6 52.7,101.6 | 52.7,101.6 49.53,101.6 | 49.53,101.6 47.62,101.6 | 47.62,101.6 42.55,101.6 41.7,102.45 | C39.2 47.62,101.6 | U4.5 49.53,103.33 49.53,101.6 | T1.2 52.7,102.79 52.7,101.6 | 18.73,17.46 19.69,16.51 20.32,16.51 27.3,16.51 | v19.05,17.78 18.73,17.46 | 65.41,17.14 64.77,16.51 48.9,16.51 47.62,16.51 | 27.3,16.51 47.62,16.51 | v47.62,17.14 47.62,16.51 | v27.3,17.14 27.3,16.51 | v64.77,17.78 65.41,17.14 | SV5.4 5.71,83.82 5.71,73.66 | 23.92,102.66 24.13,102.45
  Bottom 1.016: SV5.3 12.7,83.82 12.7,84.45 | 12.7,84.45 17.78,79.38 17.78,75.56 | 12.7,84.45 12.7,86.36 | 12.7,86.36 12.7,89.53 | SV5.1 12.7,86.36 | 40.64,102.87 IC0A.8 40.74,106.04 C1.1 | v15.88,99.69 v15.88,100.96 15.88,101.23 17.12,102.47 IC1.3 20.32,102.45 | C20.1 20.32,102.45 | 41.7,102.45 40.64,102.45 24.13,102.45 20.32,102.45 | SV5.3 SV5.4 SV5.2 SV5.1 | SV5.1 SV5.3 | SV2.10 23.5,113.03 | 23.5,113.03 23.5,103.08 23.92,102.66 | C3.1 23.5,113.03
  pour Bottom: 36.83,77.47 36.83,73.66 29.84,73.66 28.57,72.39 17.78,72.39 17.78,77.47 12.7,82.55 6.99,82.55 6.99,87.63 10.16,87.63 10.79,88.27 10.79,91.44 13.34,91.44 13.97,90.8 13.97,84.45 20.96,77.47
+24V
  Bottom 0.61: R10.2 R9.1 44.81,72.02 43.81,73.02 IC2.1
  Bottom 0.813: R19.2 61.91,107.02 D5.C
  Bottom 1.27: D5.C 67.31,100.96 63.42,97.08 C4.+ 57.15,89.53 47.31,79.69
  pour Bottom: 48.26,73.02 48.26,69.85 46.35,67.94 43.81,67.94 43.81,72.39 43.18,73.02 43.18,77.47 61.59,95.88 61.59,107.31 62.87,108.58 68.58,108.58 68.58,95.25 65.41,92.07 65.41,87.63 62.87,85.09 60.33,85.09
CMP  (via drill 0.35)
  Top 0.203: v50.16,106.04 v58.42,106.04
  Bottom 0.203: U4.2 v50.16,106.04
  Bottom 0.813: R20.2 58.42,107.31 | 58.42,107.31 R19.1 C38.2 | D4.3 v58.42,106.04 58.42,107.31
GATE_CMD  (via drill 0.35)
  Top 0.203: v56.52,102.87 v51.44,102.87
  Bottom 0.203: U4.4 51.26,102.87 v51.44,102.87 | v56.52,102.87 56.26,103.12 T1.3
GND  (via drill 0.3, 0.35)
  Top 0.254: SV8.7 15.88,76.83 15.24,76.2 SV5.9 SV5.10 v3.18,76.2 | v31.12,80.64 v25.4,80.64 | v56.52,108.58 56.39,108.46 v51.45,108.46 | v45.72,31.76 v45.72,31.75 | C29.2 C12.2 C14.2 C15.2 C26.2 C27.2 C28.2 C13.2 | C36.2 C22.2
  Bottom 0.203: C39.1 v47.62,106.04 | C1.2 v46.35,106.04 | C1.2 v44.77,107.63 | v44.77,104.45 C1.2 | v61.62,110.49 v61.61,110.48 C38.1 v62.87,109.22 | R20.1 56.5,108.57 v56.52,108.58 | D4.1 59.01,103.13 v59.01,102.23 | U4.3 51.4,104.81 v51.44,104.77
  Bottom 0.254: 13.97,76.2 SV5.9 | v16.51,62.23 16.51,63.5 v13.97,66.04 v13.97,68.58 v13.97,74.93 C7.2 | C9.- 25.32,80.72 v25.4,80.64 | C9.- 22.79,80.64 v20.32,80.64 | v8,92.07 7.87,91.95 7.96,91.86 D1.A v5.08,90.17 v3.18,90.17 v3.18,76.2 | C20.2 v20.32,96.52 | v22.1,107.06 22.08,107.07 IC1.1 18.3,107.07 v18.29,107.06 | C19.2 v6.99,107.31 | C6.2 v6.99,104.77 | C17.2 v6.99,102.23 | 22.86,79.45 22.93,79.38 v25.4,79.38 | C9.- 22.86,79.45 | C9.- 22.86,81.91 v25.4,81.91 | 22.86,79.45 22.79,79.38 v20.32,79.38 | C9.- 21.66,81.91 v20.32,81.91 | C5.2 v31.12,80.64 | IC7.2 v45.72,31.76
  Bottom 0.508: IC0A.5 36.3,105.41 35.56,105.41 v35.56,105.39 | D2.A 32.39,120.65 | D3.A v45.09,120.65
  Bottom 0.61: IC2.EP v40.01,81.91 | v40.01,81.91 v40.01,80.01 | v40.01,80.01 40.01,79.38 40.64,80.01 | 40.64,80.01 v41.91,80.01 v43.81,80.01 v43.81,81.91 | v43.81,81.91 v43.81,84.45 | v43.81,84.45 v43.81,86.36 v41.91,86.36 v40.01,86.36 v38.1,86.36 v36.2,86.36 v36.2,84.45 | v36.2,84.45 v36.2,81.91 | v36.2,81.91 v36.2,80.01 v38.1,80.01 v40.01,80.01 | v40.01,80.01 40.64,80.01 | v43.81,81.91 v41.91,81.91 v40.01,81.91 | v40.01,81.91 v38.1,81.91 v36.2,81.91 | v36.2,84.45 v38.1,84.45 v40.01,84.45 v41.91,84.45 v43.81,84.45 | C4.- 69.85,89.61 | 69.85,89.61 v69.85,91.44 | 69.85,89.61 v69.85,87.63 | C4.- v72.39,89.53 | C4.- v67.31,89.53 | IC2.4 v40.01,73.02 40.01,71.44 C37.2 39.69,70.16 v39.37,69.85 | R12.1 39.04,68.46 v37.45,68.46 | SV7.9 SV7.10 SV7.8 SV7.7 SV7.9
  Bottom 1.016: SV2.8 20.96,113.35 | 20.96,113.35 C3.2 | IC1.1 20.3,112.69 20.96,113.35 | SV9.6 SV9.5 32.39,120.65
  other vias: 35.56,56.52 46.99,83.18 53.34,89.53 23.5,89.53 20.96,89.53 18.41,89.53 22.86,97.79 22.86,100.33 38.42,56.83 38.42,53.02 38.42,49.21 38.42,45.4 38.42,37.78 38.42,41.59 38.42,33.97 40.64,34.29 43.18,34.29 43.18,38.1 40.64,38.1 40.64,41.91 43.18,41.91 40.64,45.72 43.18,45.72 40.64,49.53 43.18,49.53 40.64,53.34 43.18,53.34 40.64,58.42 43.18,58.42 63.5,24.13 62.23,26.04 62.23,21.59 35.56,24.13 34.29,26.04 34.29,21.59 52.7,75.56 49.53,73.02 54.61,73.66 51.44,71.12 49.53,69.21 59.69,83.18 46.99,66.67 31.75,66.67 62.23,80.64 39.37,66.67 35.56,66.67 37.47,66.67 33.66,66.67 35.56,68.58 31.75,68.58 35.56,71.12 31.75,71.12 18.41,71.12 22.23,66.67 50.8,91.44 45.72,96.52 43.18,99.06 33.02,99.06 29.21,99.06 31.75,96.52 35.56,96.52 59.05,99.69 69.85,96.52 38.42,32.07 38.42,35.88 38.42,39.69 38.42,43.5 38.42,47.31 38.42,51.12 38.42,54.93 38.42,58.74 47.62,33.66 47.62,37.47 47.62,41.27 47.62,45.09 47.62,48.9 47.62,52.7 47.62,56.52 57.79,48.26 57.47,44.77 57.79,52.07 57.79,54.61 56.2,41.59 54.29,39.37 51.75,37.15 51.44,33.34 50.48,31.43 47.31,29.53 50.48,28.26 35.56,33.66 35.56,37.47 35.56,41.27 35.56,45.09 35.56,48.9 35.56,52.7 30.48,61.28 66.04,53.34 69.22,49.53 68.58,53.98 71.75,50.8 64.13,43.81 69.85,41.91 62.55,41.59 72.07,39.69 81.6,32.7 22.86,33.02 15.88,33.02 22.23,41.91 19.05,43.18 47.62,27.3 36.2,27.3 37.47,29.84 44.45,29.84 57.79,59.05 65.72,64.45 65.72,60.64 68.9,61.28 61.91,68.26 59.37,70.8 57.47,71.44 52.39,66.36 54.93,68.9 66.99,80.96 64.45,83.5 59.37,95.57 56.2,91.76 28.89,103.82 33.02,100.96 27.3,100.65 20,61.28 17.78,20.32 15.88,18.41 10.79,23.5 43.81,18.41 43.81,15.24 36.83,15.24 36.83,18.41 62.23,18.41 64.77,13.97 68.9,18.73 66.36,20.64 32.7,60.01 19.05,46.04 25.4,52.39 19.05,49.85 25.4,55.56 26.35,113.98 13.65,111.44 13.65,114.62 11.11,125.41 25.72,125.41 16.19,111.44 5.71,110.49 5.71,113.03 5.71,115.57
  pour Bottom (rank 6): -6.35,131.54 -6.35,-8.25 97.16,-8.25 97.16,131.54
  pour Top (rank 6): -5.08,-7.62 95.88,-7.62 95.88,129.64 -5.08,129.64
N$1
  Bottom 0.254: IC7.4 49.52,32.4 49.53,32.38 51.44,32.38 52.07,31.75 IC9.2
N$2
  Bottom 0.254: IC5.4 50.79,40.02 54.61,36.2 IC9.4
N$3  (via drill 0.35)
  Top 0.254: v67.27,78.09 67.27,78.88 60.96,85.18 60.96,109.8 54.64,116.12 54.64,117.66 USB1.2
  Bottom 0.254: v67.27,78.09 67.27,69.56 R3.2
N$4
  Bottom 0.254: IC9.5 55.88,40.64 52.69,43.83 IC6.4
N$9
  Bottom 0.254: IC4.4 52.05,36.21 53.34,34.93 IC9.3
N$10
  Bottom 0.406: IC9.18 53.34,10.8 50.16,7.62 X1.3
N$11
  Bottom 0.254: 39.37,109.49 R2.2 | DMX_F1.1 41.27,113.03 41.62,113.37
  Bottom 0.61: IC0A.7 39.37,109.49 | R2.2 41.27,111.39 41.27,113.03 | D3.C 41.62,113.37
N$12
  Bottom 0.254: DMX_F2.1 36.2,113.03 35.86,113.37
  Bottom 0.61: IC0A.6 38.1,109.49 R2.1 36.2,111.39 36.2,113.03 | D2.C 35.86,113.37
N$13  (via drill 0.35)
  Top 0.254: USB1.3 53.66,119.67 53.45,119.46 53.45,115.46 60.32,108.58 60.33,108.58 60.33,84.64 65.04,79.93 v65.04,78.93
  Bottom 0.254: v65.04,78.93 64.31,78.2 R4.2
N$16
  Bottom 0.152: R1.1 33.95,72.96 33.95,72.71
  Bottom 0.61: IC2.6 37.47,73.02 37.15,72.71 33.95,72.71 33.66,72.71 | C2.1 33.66,72.71 | R8.2 R1.1 33.66,72.71
N$19
  Bottom 0.254: IC9.6 57.15,43.18 52.69,47.64 IC18.4
N$20
  Bottom 0.61: IC2.2 42.55,71.39 R9.2
N$21
  Bottom 0.254: IC21.2 24.13,47.83 32.92,56.62 33.55,56.62 IC11.4
N$22
  Bottom 0.61: IC2.5 38.73,73.02 37.79,72.07 C37.1
N$23
  Bottom 0.254: IC9.9 60.96,50.16 52.05,59.07 IC17.4
N$24
  Bottom 0.61: IC2.3 41.27,68.58 | R10.1 41.27,68.58 | 41.27,68.58 R12.2
N$25
  Bottom 1.27: 67.63,111.74 D5.A | 74.64,111.42 U1B.P$1
  Bottom 2.54: D5.A 70.49,111.42 | 70.49,111.42 74.64,111.42 | U1.1 70.49,111.42
N$26
  Bottom 0.254: IC9.8 59.69,48.9 53.33,55.26 IC16.4
N$27
  Bottom 0.254: IC15.4 52.69,51.45 58.42,45.72 IC9.7
N$28
  Bottom 0.406: IC9.17 54.61,9.52 52.7,7.62 X1.5
N$29
  Bottom 0.406: IC9.16 55.88,8.25 55.24,7.62 X1.7
N$30
  Bottom 0.406: IC9.15 57.15,8.25 57.79,7.62 X1.9
N$31
  Bottom 0.61: DMX_F1.2 DMX.3
N$32
  Bottom 0.61: DMX_F2.2 DMX.1
N$33
  Bottom 0.254: IC21.4 26.67,42.11 IC8.4
N$34
  Bottom 0.254: IC21.5 27.94,39.57 IC10.4
N$35
  Bottom 0.254: IC21.6 29.21,37.03 IC20.4
N$36
  Bottom 0.254: IC21.9 33.02,29.41 IC14.4
N$37
  Bottom 0.254: IC13.4 33.55,33.76 32.48,33.76 31.75,33.02 IC21.8
N$38
  Bottom 0.254: IC12.4 32.19,36.2 31.12,36.2 30.48,35.56 IC21.7
N$39
  Bottom 0.254: IC21.3 25.4,44.65 IC3.4
N$40
  Bottom 0.406: USB1.1 57.13,116.14 54.26,113.28 R13.2
N$41
  Bottom 0.813: R14.2 66.08,36.79 CLK.2
N$42
  Bottom 0.406: IC21.18 25.4,12.07 23.5,10.16 13.34,10.16 X3.3
N$43
  Bottom 0.406: IC21.17 26.67,12.07 23.5,8.89 14.61,8.89 X3.5
N$44
  Bottom 0.406: IC21.16 27.94,12.07 23.5,7.62 15.88,7.62 X3.7
N$45
  Bottom 0.406: IC21.15 29.21,12.07 23.5,6.35 17.14,6.35 X3.9
N$46
  Bottom 0.406: X4.3 30.48,6.99 IC21.14
N$47
  Bottom 0.406: IC21.13 X4.5
N$48
  Bottom 0.406: IC21.12 33.02,8.25 34.29,6.99 X4.7
N$49
  Bottom 0.406: IC21.11 34.29,9.52 36.83,6.99 X4.9
N$50
  Bottom 0.406: IC9.14 58.42,12.07 61.59,8.89 67.94,8.89 70.49,6.35 X2.3
N$51
  Bottom 0.406: IC9.13 59.69,12.07 61.59,10.16 69.22,10.16 73.03,6.35 X2.5
N$52
  Bottom 0.406: IC9.12 60.96,12.07 61.59,11.43 70.49,11.43 75.56,6.35 X2.7
N$53
  Bottom 0.254: IC9.11 62.23,13.34
  Bottom 0.406: 62.23,13.34 62.87,12.7 71.75,12.7 78.1,6.35 X2.9
PA4
  Top 0.254: SV5.28 SPI3.5
PA5
  Top 0.254: SPI3.4 5.08,50.8 6.35,52.07 9.53,52.07 SV5.27
PA6
  Top 0.254: SV5.30 9.19,50.8 10.33,51.93 11.26,51.93 11.93,51.27 11.93,50.33 11.26,49.67 10.15,49.67 9.39,48.91 9.39,47.79 8.72,47.13 4.58,47.13 SPI3.2
PA7
  Top 0.254: SV5.29 9.86,50.8 8.72,49.67 6.49,49.67 5.08,48.26 SPI3.3
PA9
  Top 0.254: SV7.33 UART1.2
PA10
  Top 0.254: SV7.34 75.56,46.99 80.01,46.99 UART1.3
PA11/USB_DM
  Bottom 0.254: SV7.31 75.56,49.53 70.58,49.53 67.13,52.98 R3.1
PA12/USB_DP
  Bottom 0.254: SV7.32 69.49,48.26 64.36,53.39 64.36,67.68 R4.1
PA15  (via drill 0.35)
  Top 0.254: SV7.29 75.58,52.06 75.58,53.91 74.89,54.6 73.67,54.6 58.42,69.85 58.42,74.29 40.01,92.71 36.83,92.71 27.3,102.23 v27.3,104.14 14.61,116.84 14.61,119.38 SV2.3
  Bottom 0.254: v27.3,104.14 27.3,111.76 SV9.2
PB3
  Top 0.254: SV7.17 75.56,67.31 73.03,67.31 38.08,102.26 35.53,102.26 30.48,107.31 30.48,113.66 SV9.3 26.67,117.47 26.67,121.28 23.5,124.46 15.88,124.46 13.34,121.92 SV2.1
PB4  (via drill 0.35)
  Top 0.254: SV8.1 25.4,84.45 26.04,85.09 26.04,103.5 v25.4,104.14 25.4,104.77 19.69,110.49 SV10.6
  Bottom 0.254: SV2.7 20.96,121.92 21.59,122.55 24.77,122.55 25.4,121.92 v25.4,104.14
PB5
  Top 0.254: SV7.18 73.66,66.04 38.1,101.6 34.92,101.6 19.69,116.84 19.69,119.38 SV2.5
  Bottom 0.254: SV2.5 18.41,121.28 20.32,123.19 25.4,123.19 26.67,121.92 26.67,120.02 SV9.4
PB6
  Top 0.254: SV7.15 I2C1.2
PB7
  Top 0.254: I2C1.3 80.01,71.12 78.74,69.85 75.56,69.85 SV7.16
PB8  (via drill 0.35)
  Top 0.254: SV7.13 75.56,72.39 68.58,72.39 38.1,102.87 36.2,102.87 v33.66,105.41 | v28.57,105.41 SV2.4
  Bottom 0.254: v33.66,105.41 v28.57,105.41 SV9.1
PB10
  Top 0.254: SV5.43 12.7,33.02 13.34,32.38 13.34,26.67 12.07,25.4 I2C2.2
PB11
  Top 0.254: I2C2.3 4.45,27.94 6.99,30.48 SV5.46
PB12  (via drill 0.35)
  Top 0.254: SPI2.5 v6.99,67.31
  Bottom 0.254: SV5.45 11.43,30.48 13.34,32.38 | 13.34,32.38 13.36,32.38 | v6.99,67.31 11.43,67.31 13.34,65.4 13.34,32.38
PB13  (via drill 0.35)
  Top 0.254: SPI2.4 6.99,64.77 11.43,64.77 14.61,61.6 v14.61,60.33
  Bottom 0.254: SV5.48 9.53,29.21 11.43,29.21 14.61,32.38 v14.61,60.33
PC2
  Top 0.254: SV5.20 6.99,63.5 4.45,66.04 SPI2.3
PC3
  Top 0.254: SPI2.2 3.81,63.5 4.94,62.37 9.66,62.37 SV5.19
PD3  (via drill 0.35)
  Top 0.254: SV7.24 73.66,58.42 59.05,73.02 59.05,74.29 39.94,93.41 37.4,93.41 30.48,100.33 30.48,104.77 18.41,116.84 SV2.6 | SV10.5 v13.34,113.03
  Bottom 0.254: v13.34,113.03 14.61,113.03 18.41,116.84 SV2.6
PD4  (via drill 0.35)
  Top 0.254: SV7.21 75.43,62.37 73.52,62.37 40.89,95 39.62,95 v38.1,96.52
  Bottom 0.305: IC0A.3 v38.1,96.52
PD5  (via drill 0.35)
  Top 0.254: SV7.22 73.66,60.96 40.26,94.36 38.99,94.36 v36.83,96.52
  Bottom 0.305: v36.83,96.52 IC0A.4
PD6  (via drill 0.35)
  Top 0.254: SV7.19 75.56,64.77 72.39,64.77 v40.64,96.52
  Bottom 0.305: v40.64,96.52 IC0A.1
PD7  (via drill 0.35)
  Top 0.254: SV7.20 72.97,63.5 40.86,95.6 40.29,95.6 v39.37,96.52
  Bottom 0.305: IC0A.2 v39.37,96.52
PD8
  Top 0.254: SV7.48 74.29,26.67 76.2,24.77 UART3.2
PD9
  Top 0.254: UART3.3 80.01,27.3 SV7.45
PD12
  Bottom 0.254: R14.1 67.78,38.23 73.12,33.02 SV7.44
PD13
  Bottom 0.254: 67.94,41.91 R7.1 68.58,41.91 69.85,40.64 69.85,38.1 73.66,34.29 75.56,34.29 SV7.41
PD14
  Bottom 0.254: R11.1 67.91,45.09 69.22,45.09 71.12,43.18 71.12,38.1 73.66,35.56 SV7.42
PE0  (via drill 0.35)
  Top 0.254: v50.16,29.84 50.8,29.84 53.66,32.7 53.66,35.24 v70.49,52.07
  Bottom 0.254: v50.16,29.84 48.9,29.84 48.48,30.27 IC7.6 | SV7.11 75.56,72.39 72.39,72.39 71.75,71.75 71.75,53.34 v70.49,52.07
PE1  (via drill 0.35)
  Top 0.254: v51.44,34.93 v70.49,53.98
  Bottom 0.254: SV7.12 72.39,73.66 70.49,71.75 v70.49,53.98 | IC4.6 49.31,34.07 50.58,34.07 v51.44,34.93
PE2  (via drill 0.35)
  Top 0.254: SV5.12 9.53,74.93 12.58,74.93 21.61,65.9 50.31,65.9 56.52,59.69 56.52,43.81 v50.16,37.47
  Bottom 0.254: IC5.6 49.73,37.47 v50.16,37.47
PE3  (via drill 0.35)
  Top 0.254: SV5.11 12.64,73.66 21.15,65.15 49.78,65.15 55.59,59.34 55.59,46.7 v50.16,41.27
  Bottom 0.254: IC6.6 49.73,41.27 v50.16,41.27
PE4  (via drill 0.35)
  Top 0.254: SV5.14 9.53,72.39 13.34,72.39 21.18,64.54 49.06,64.54 54.38,59.22 54.38,49.3 v50.8,45.72
  Bottom 0.254: v50.8,45.72 48.9,45.72 48.48,46.14 IC18.6
PE5  (via drill 0.35)
  Top 0.254: SV5.13 13.34,71.12 20.96,63.5 48.9,63.5 53.34,59.05 53.34,52.07 v50.8,49.53
  Bottom 0.254: v50.8,49.53 49.83,49.53 49.8,49.51 49.26,49.51 48.62,50.15 IC15.6
PE6  (via drill 0.35)
  Top 0.254: SV5.16 9.53,67.31 15.24,67.31 19.69,62.87 48.26,62.87 52.09,59.03 52.09,54 v51.44,53.34
  Bottom 0.254: v51.44,53.34 49.83,53.34 49.8,53.32 49.12,53.32 IC16.6
PE7  (via drill 0.35)
  Top 0.254: SV5.36 9.53,44.45 15.88,44.45 33.02,61.6 47.62,61.6 v51.44,57.79
  Bottom 0.254: v51.44,57.79 50.78,57.13 49.12,57.13 IC17.6
PE8  (via drill 0.35)
  Top 0.254: SV5.35 17.78,43.18 v27.94,53.34
  Bottom 0.254: IC11.6 33.73,59.07 28,53.34 v27.94,53.34
PE9  (via drill 0.35)
  Top 0.254: 8.89,41.27 SV5.38 9.53,41.91 19.69,41.91 v27.94,50.16
  Bottom 0.254: v27.94,50.16 33.03,55.26 IC3.6
PE10  (via drill 0.35)
  Top 0.254: SV5.37 22.86,40.64 v27.94,45.72
  Bottom 0.254: IC8.6 33.67,51.45 v27.94,45.72
PE11  (via drill 0.35)
  Top 0.254: SV5.40 9.53,39.37 25.4,39.37 v27.94,41.91
  Bottom 0.254: v27.94,41.91 33.67,47.64 IC10.6
PE12  (via drill 0.35)
  Top 0.254: v29.84,39.37 28.57,38.1 SV5.39
  Bottom 0.254: IC20.6 33.67,43.83 29.84,40.01 v29.84,39.37
PE13  (via drill 0.35)
  Top 0.254: SV5.42 9.53,36.83 v30.48,36.83
  Bottom 0.254: v30.48,36.83 33.67,40.02 IC12.6
PE14  (via drill 0.35)
  Top 0.254: v31.75,34.93 31.12,35.56 SV5.41
  Bottom 0.254: IC13.6 33.03,36.21 v31.75,34.93
PE15  (via drill 0.35)
  Top 0.254: v33.02,32.38 32.39,32.38 30.62,34.15 9.39,34.15 SV5.44
  Bottom 0.254: v33.02,32.38 34.7,32.38 IC14.6
TCK_H  (via drill 0.35)
  Top 0.254: v39.37,57.77 39.37,59.69 v45.72,59.69 v45.72,55.88 v45.72,52.07 v45.72,48.26 v45.72,44.45 v45.72,40.64 v45.72,36.83 v45.72,33.02
  Bottom 0.254: IC14.3 38.72,31.1 39.37,31.75 39.37,34.91 | 39.37,34.91 39.37,38.72 | 39.37,38.72 39.37,42.53 | 39.37,42.53 39.37,46.34 | 39.37,46.34 39.37,50.15 | 39.37,50.15 39.37,53.96 | 39.37,53.96 v39.37,57.77 IC11.3 | IC3.3 39.37,53.96 | IC8.3 39.37,50.15 | IC10.3 39.37,46.34 | IC20.3 39.37,42.53 | IC12.3 39.37,38.72 | IC13.3 39.37,34.91 | IC4.3 46.77,36.83 v45.72,36.83 | R7.2 64.13,41.91 62.84,43.21 62.84,50.83 52.7,60.96 46.35,60.96 45.72,60.33 v45.72,59.69 46.34,59.07 IC17.3 | v45.72,55.88 46.34,55.26 IC16.3 | v45.72,52.07 46.34,51.45 IC15.3 | v45.72,48.26 46.34,47.64 IC18.3 | v45.72,44.45 46.34,43.83 IC6.3 | v45.72,40.64 46.34,40.02 IC5.3 | v45.72,33.02 46.34,32.4 IC7.3
TCK_L  (via drill 0.35)
  Top 0.254: v37.47,33.02 v37.47,36.83 v37.47,40.64 v37.47,44.45 v37.47,48.26 v37.47,52.07 v37.47,55.88 v37.47,59.69
  Bottom 0.254: IC7.1 45.1,31.1 44.45,31.75 44.45,34.91 | 44.45,34.91 44.45,38.72 | 44.45,38.72 44.45,42.53 | 44.45,42.53 44.45,46.34 | 44.45,46.34 44.45,50.15 | 44.45,50.15 44.45,53.96 | 44.45,53.96 44.45,57.77 | IC17.1 44.45,57.77 | IC16.1 44.45,53.96 | IC15.1 44.45,50.15 | IC18.1 44.45,46.34 | IC6.1 44.45,42.53 | IC5.1 44.45,38.72 | IC4.1 44.45,34.91 | 44.45,59.69 v37.47,59.69 36.84,59.07 IC11.1 | 44.45,59.69 44.45,57.77 | 44.45,59.69 44.45,60.96 45.72,62.23 53.02,62.23 64.13,51.12 64.13,45.72 64.9,44.96 R11.2 | v37.47,55.88 36.84,55.26 IC3.1 | v37.47,52.07 36.84,51.45 IC8.1 | v37.47,48.26 36.84,47.64 IC10.1 | IC20.1 36.84,43.83 v37.47,44.45 | v37.47,40.64 36.84,40.02 IC12.1 | v37.47,36.83 36.84,36.21 IC13.1 | v37.47,33.02 36.84,32.4 IC14.1
USBVCC
  Bottom 0.813: R13.1 53.98,105.18 T1.1
V_ETH  (via drill 0.35)
  Top 1.016: SV2.9 23.5,122.55 22.86,123.19 v18.41,123.19
  Bottom 1.016: IC1.2 IC1.4 | IC1.4 13.97,104.77 | 13.97,104.77 C6.1 | C19.1 C6.1 | C6.1 C17.1 | C19.1 10.79,107.38 | L5.2 15.88,97.37 13.97,99.27 13.97,104.77 | IC1.4 13.97,104.8 | C19.1 10.73,118.11 | 10.73,118.11 10.73,120.65 | v18.41,123.19 11.43,123.19 10.73,122.49 10.73,120.65 | 10.73,120.65 SV10.2 SV10.3 10.73,118.11

### Text on the board
tPlace: SCK | nSS | MOSI | MISO | +3V3 | nINT | nRST | GND | +5V | DMX A | GND | DMX B | GND | 3V3
bPlace: Ethernet
tNames: HyperLight LED Controller | for Black VET6 | STM32F407VET6 | +5V | +5V | CS | SDA | SCK | SCL | MISO | GND | MOSI | www.chaozlabs.de | GND | +5V | CS | SCK | +5V | MISO | RX | MOSI | TX | GND | GND | +5V | +5V | SDA | RX | SCL | TX | GND | GND
bNames: + | GND